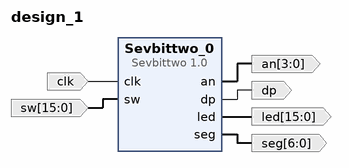
[diagram p0: block diagram of the top level]
# Vivado block design design_1, Vivado 2015.1
create_bd_design design_1

create_bd_port -dir I -type clk clk
create_bd_port -dir I -from 15 -to 0 sw
create_bd_port -dir O -from 15 -to 0 led
create_bd_port -dir O -from 6 -to 0 seg
create_bd_port -dir O -from 3 -to 0 an
create_bd_port -dir O dp

create_bd_cell -type ip -vlnv user.org:user:Sevbittwo:1.0 Sevbittwo_0

# ---- connections ----

connect_bd_net [get_bd_ports clk] [get_bd_pins Sevbittwo_0/clk]
connect_bd_net [get_bd_ports sw] [get_bd_pins Sevbittwo_0/sw]
connect_bd_net [get_bd_pins Sevbittwo_0/led] [get_bd_ports led]
connect_bd_net [get_bd_pins Sevbittwo_0/seg] [get_bd_ports seg]
connect_bd_net [get_bd_pins Sevbittwo_0/an] [get_bd_ports an]
connect_bd_net [get_bd_pins Sevbittwo_0/dp] [get_bd_ports dp]

validate_bd_design
save_bd_design
